# EasyEDA Pro project ProPrj_STM32 数控可调直流电源_2026-05-18.epro, schematic Schematic1

## Sheets
1 电源: Board Name: Board1; Create Date: 2026-03-24; Page Name: 电源; Project Name: STM32 数控可调直流电源; Schematic Name: Schematic1; Update Date: 2026-04-09; BladeWidth: 10; Company: 嘉立创EDA; Page Size: A4; RegionStart: 1; ShowBorder: 1; TitleBlock: 1; TitleBlockPosition: 3; Version: V1.0; XRegionCount: 6; YRegionCount: 4
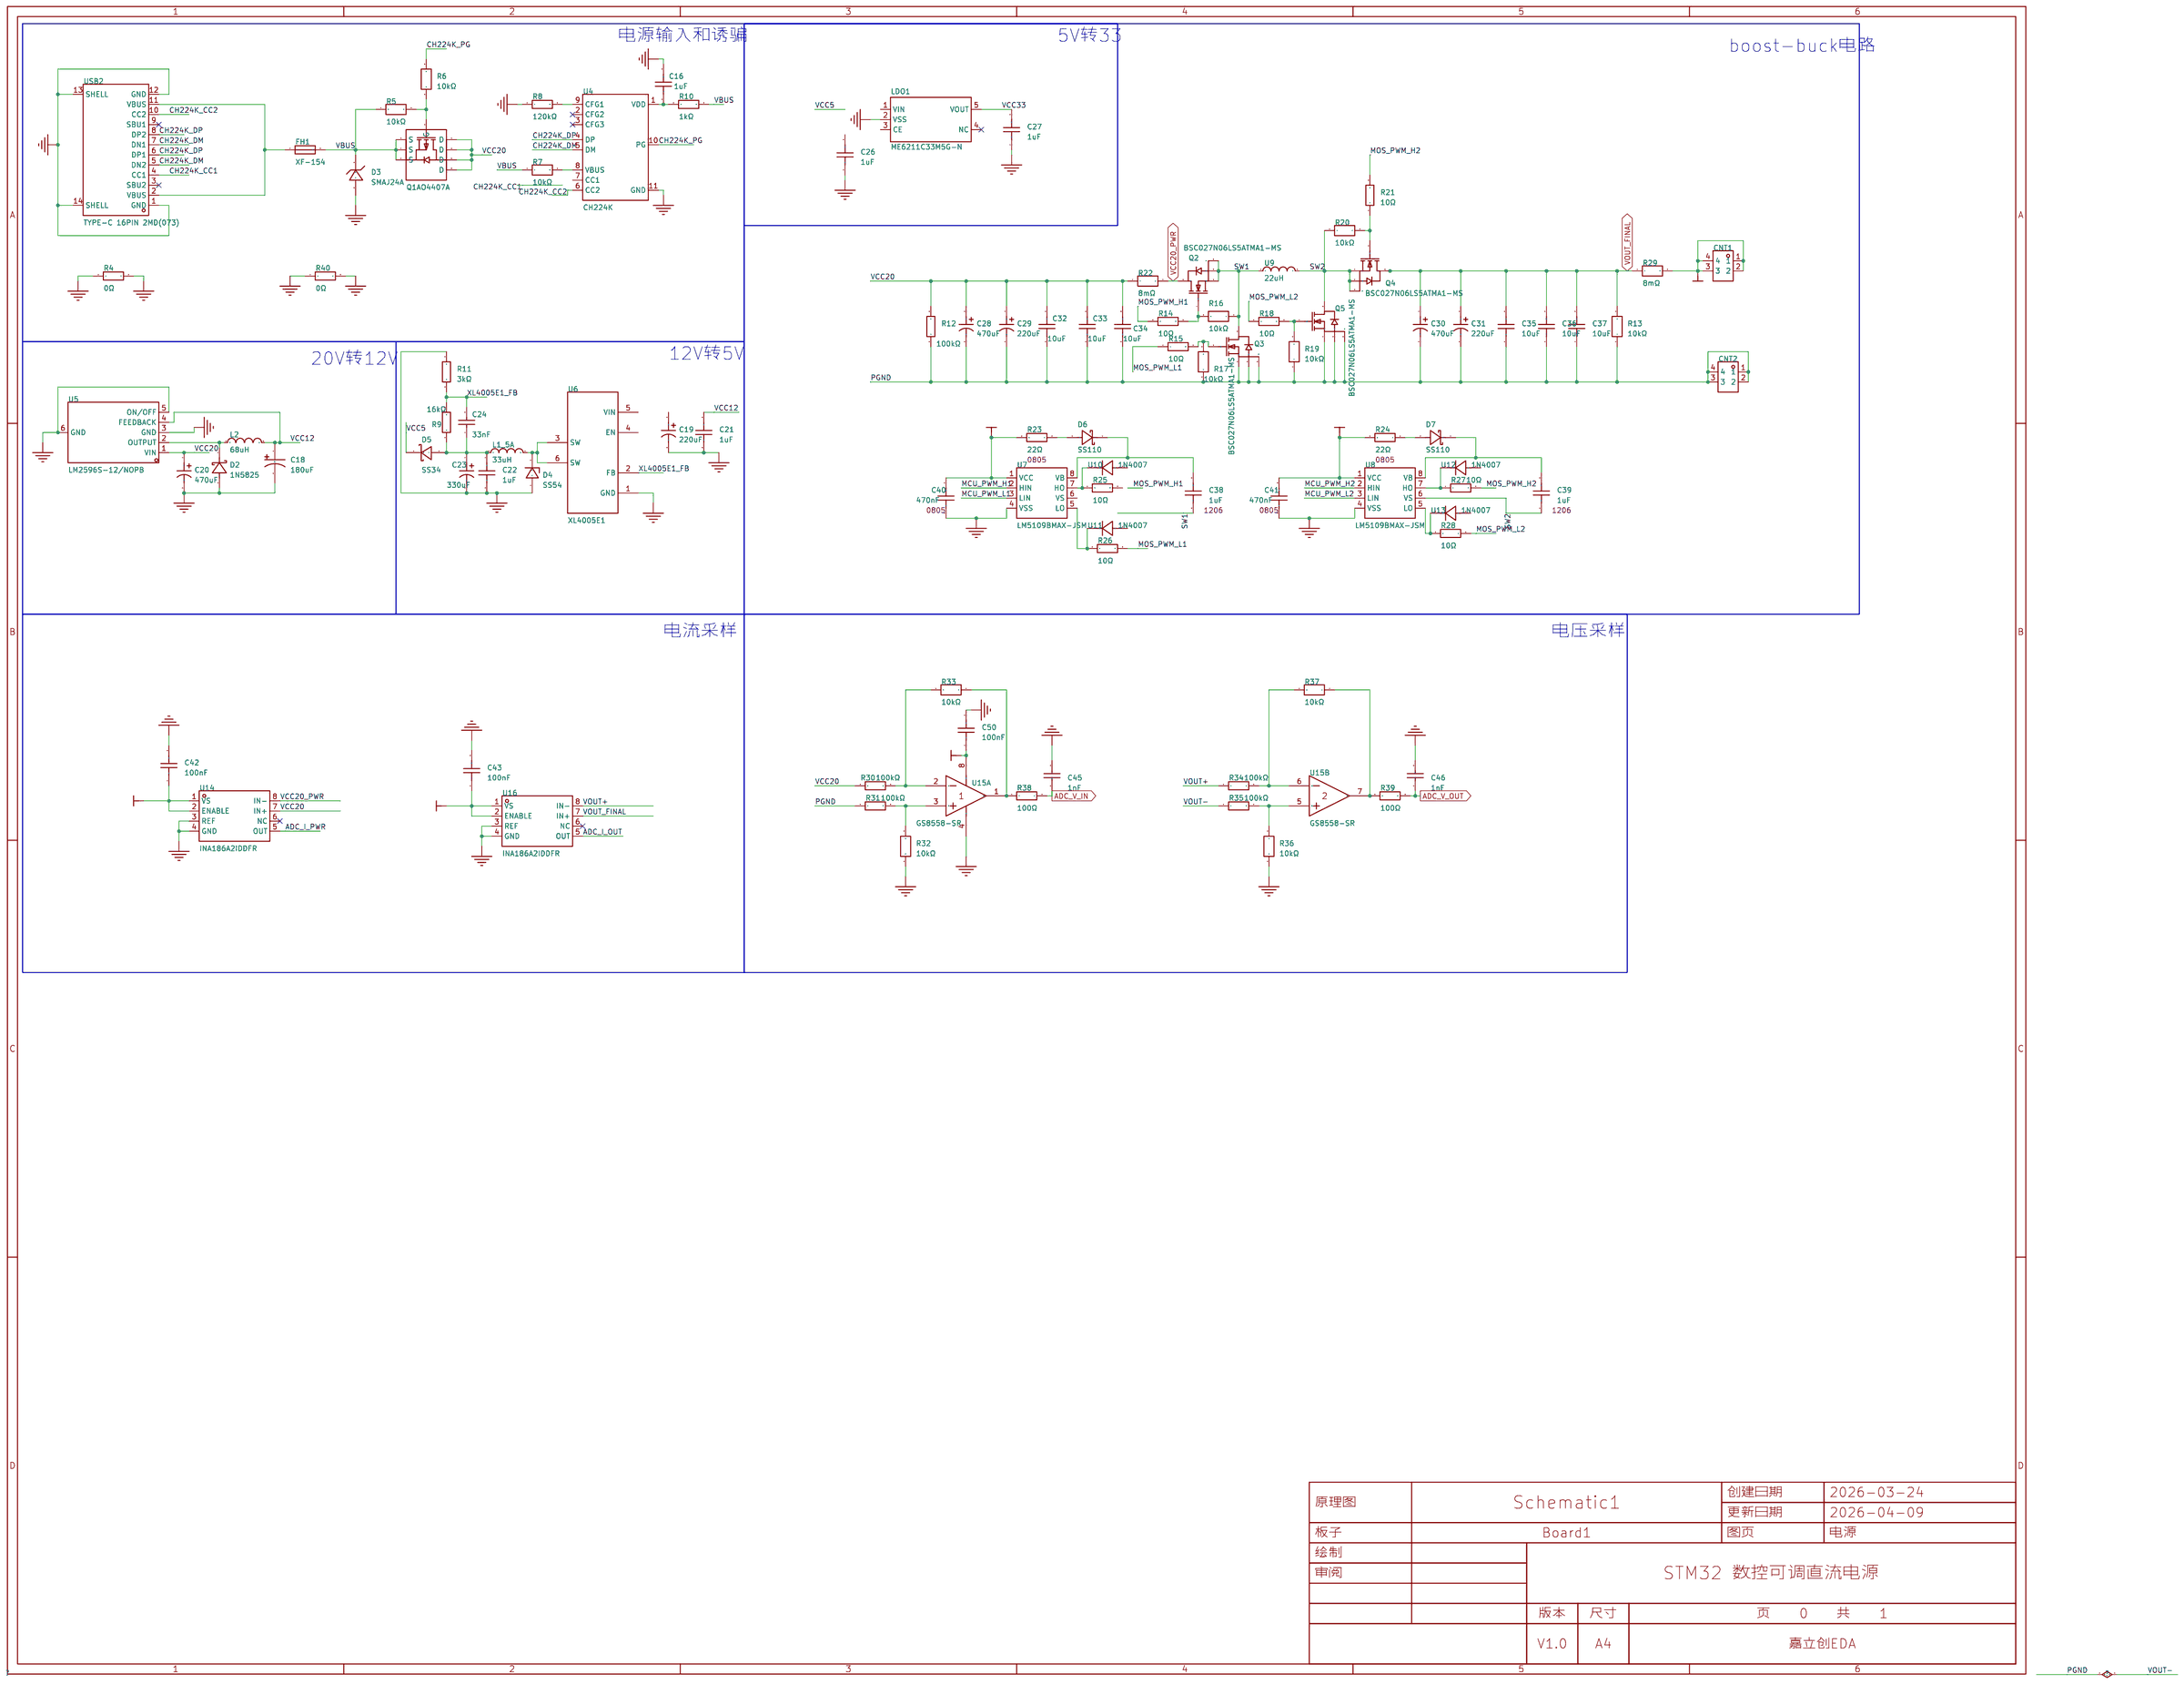
[diagram p0: 电源]
2 主控: Assembly Variant: Basic; Page Name: P2; Update Date: 2026-03-24
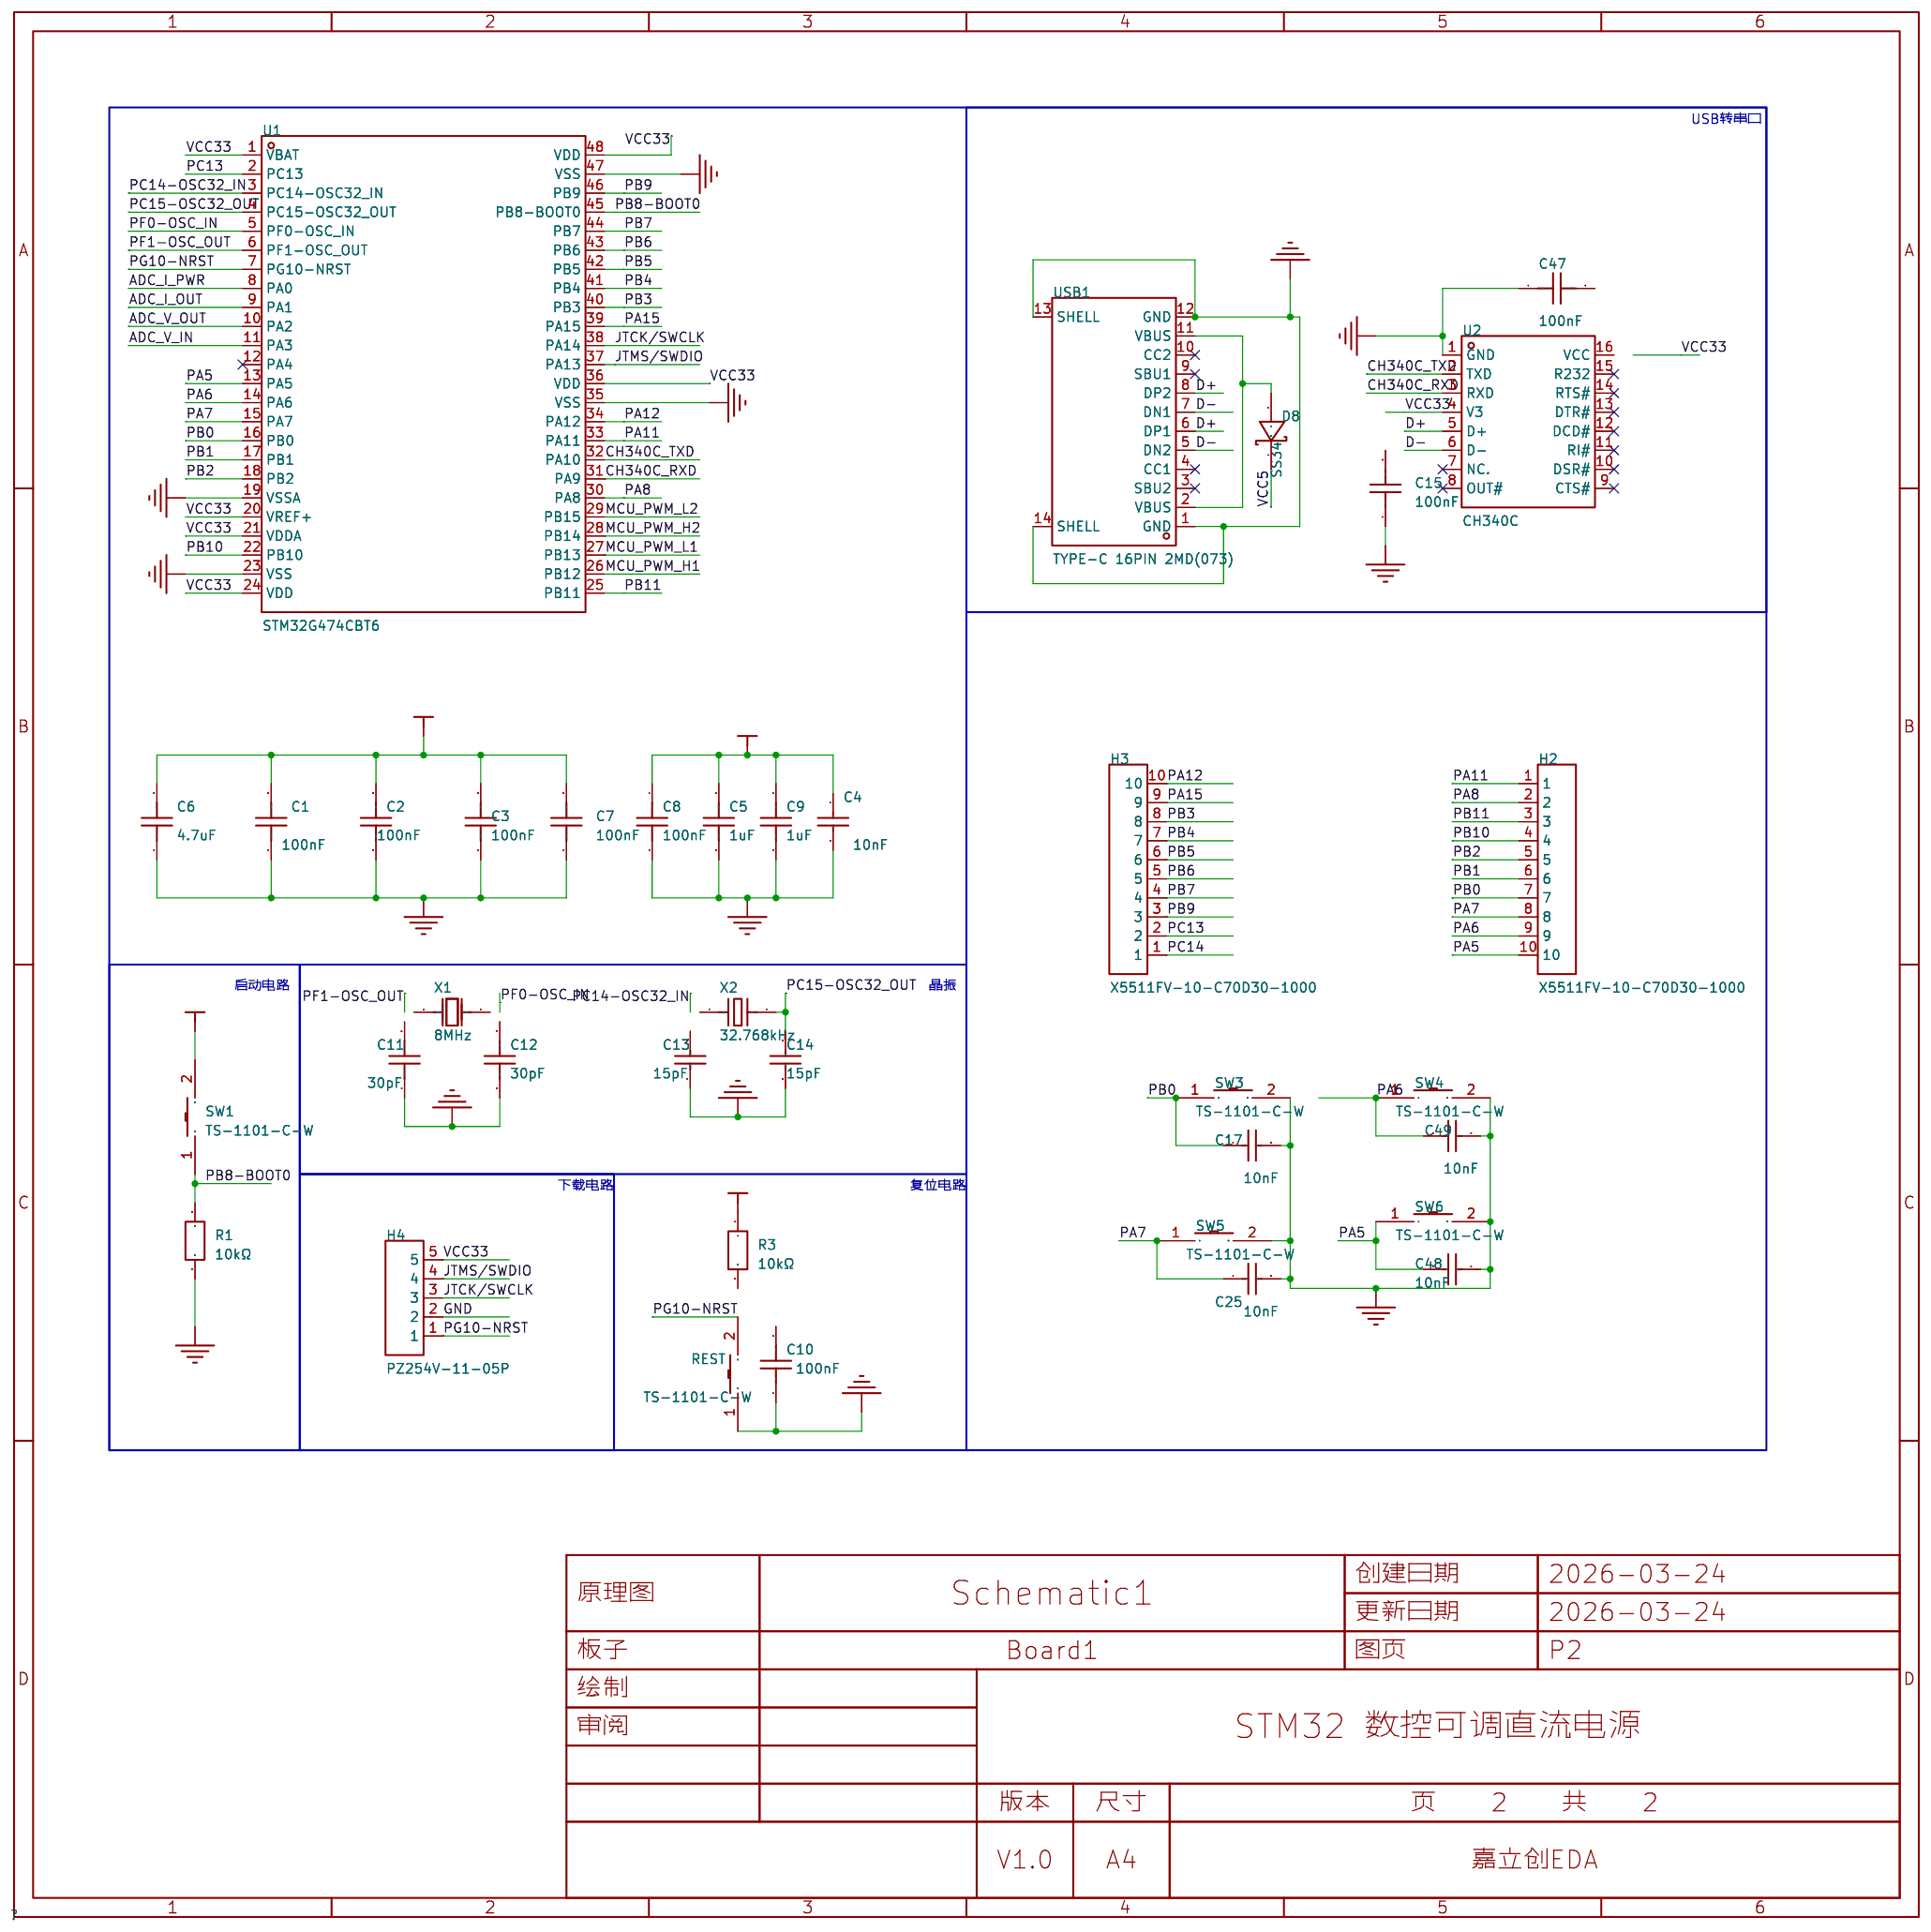
[diagram p1: 主控]

## Parts
sheet 主控
C1  100nF  [C0603]
C2  100nF  [C0603]
C3  100nF  [C0603]
C4  10nF  [C0603]
C5  1uF  [C0603]
C6  4.7uF  [C0603]
C7  100nF  [C0603]
C8  100nF  [C0603]
C9  1uF  [C0603]
C10  100nF  [C0603]
C11  30pF  [C0603]
C12  30pF  [C0603]
C13  15pF  [C0603]
C14  15pF  [C0603]
C15  100nF  [C0603]
C17  10nF  [C0603]
C25  10nF  [C0603]
C47  100nF  [C0603]
C48  10nF  [C0603]
C49  10nF  [C0603]
D8  SS34  [SMC_L6.9-W5.9-LS7.9-RD]
H2  X5511FV-10-C70D30-1000  [HDR-TH_10P-P2.54-V-F]
H3  X5511FV-10-C70D30-1000  [HDR-TH_10P-P2.54-V-F]
H4  PZ254V-11-05P  [HDR-TH_5P-P2.54-V-M]
R1  10kΩ  [R0603]
R3  10kΩ  [R0603]
REST  TS-1101-C-W  [SW-SMD_L6.0-W3.3-LS8.0]
SW1  TS-1101-C-W  [SW-SMD_L6.0-W3.3-LS8.0]
SW3  TS-1101-C-W  [SW-SMD_L6.0-W3.3-LS8.0]
SW4  TS-1101-C-W  [SW-SMD_L6.0-W3.3-LS8.0]
SW5  TS-1101-C-W  [SW-SMD_L6.0-W3.3-LS8.0]
SW6  TS-1101-C-W  [SW-SMD_L6.0-W3.3-LS8.0]
U1  STM32G474CBT6  [LQFP-48_L7.0-W7.0-P0.50-LS9.0-BL]
U2  CH340C  [SOP-16_L10.0-W3.9-P1.27-LS6.0-BL]
USB1  TYPE-C 16PIN 2MD(073)  [USB-C-SMD_TYPE-C-6PIN-2MD-073]
X1  8MHz  [CRYSTAL-SMD_L11.5-W4.8-LS12.7]
X2  32.768kHz  [OSC-SMD_L3.2-W1.5]
sheet 电源
C16  1uF  [C0603]
C18  180uF  [CAP-TH_BD8.0-P3.50-D0.6-FD]
C19  220uF  [CAP-TH_BD8.0-P3.50-D0.5-FD]
C20  470uF  [CAP-TH_BD10.0-P5.00-D0.6-FD]
C21  1uF  [C0603]
C22  1uF  [C0603]
C23  330uF  [CAP-TH_BD8.0-P3.50-D0.5-FD]
C24  33nF  [C0603]
C26  1uF  [C0603]
C27  1uF  [C0603]
C28  470uF  [CAP-TH_BD10.0-P5.00-D0.6-FD-A]
C29  220uF  [CAP-TH_BD10.0-P5.00-D0.6-FD_ERG50V220M10X13]
C30  470uF  [CAP-TH_BD10.0-P5.00-D0.6-FD-A]
C31  220uF  [CAP-TH_BD10.0-P5.00-D0.6-FD_ERG50V220M10X13]
C32  10uF  [C0805]
C33  10uF  [C0805]
C34  10uF  [C0805]
C35  10uF  [C0805]
C36  10uF  [C0805]
C37  10uF  [C0805]
C38  1uF  [C1206]
C39  1uF  [C1206]
C40  470nF  [C0805]
C41  470nF  [C0805]
C42  100nF  [C0603]
C43  100nF  [C0603]
C45  1nF  [C0603]
C46  1nF  [C0603]
C50  100nF  [C0603]
CNT1  T34001  [CONN-TH_T34001]
CNT2  T34001  [CONN-TH_T34001]
D2  1N5825  [DIO-TH_BD11.4-L8.9-P13.7-RD]
D3  SMAJ24A  [SMA_L4.4-W2.6-LS5.0-RD]
D4  SS54  [SMA_L4.3-W2.6-LS5.0-FD]
D5  SS34  [SMC_L6.9-W5.9-LS7.9-RD]
D6  SS110  [SMA_L4.3-W2.6-LS5.0-RD]
D7  SS110  [SMA_L4.3-W2.6-LS5.0-RD]
FH1  XF-154  [FUSE-SMD_L10.5-W5.1]
L1_5A  33uH  [IND-SMD_L11.5-W10.5]
L2  68uH  [IND-SMD_L12.3-W12.3_SMDRI127]
LDO1  ME6211C33M5G-N  [SOT-23-5_L3.0-W1.7-P0.95-LS2.8-BL]
Q1  AO4407A  [SOIC-8_L4.9-W3.9-P1.27-LS6.0-BL]
Q2  BSC027N06LS5ATMA1-MS  [TDSON-8_L5.9-W5.2-P1.27-BL-1]
Q3  BSC027N06LS5ATMA1-MS  [TDSON-8_L5.9-W5.2-P1.27-BL-1]
Q4  BSC027N06LS5ATMA1-MS  [TDSON-8_L5.9-W5.2-P1.27-BL-1]
Q5  BSC027N06LS5ATMA1-MS  [TDSON-8_L5.9-W5.2-P1.27-BL-1]
R4  0Ω  [R0603]
R5  10kΩ  [R0603]
R6  10kΩ  [R0603]
R7  10kΩ  [R0603]
R8  120kΩ  [R0603]
R9  16kΩ  [R0603]
R10  1kΩ  [R0603]
R11  3kΩ  [R0603]
R12  100kΩ  [R0603]
R13  10kΩ  [R0603]
R14  10Ω  [R0603]
R15  10Ω  [R0603]
R16  10kΩ  [R0603]
R17  10kΩ  [R0603]
R18  10Ω  [R0603]
R19  10kΩ  [R0603]
R20  10kΩ  [R0603]
R21  10Ω  [R0603]
R22  8mΩ  [RES-SMD_L6.4-W3.2-R2512]
R23  22Ω  [R0805]
R24  22Ω  [R0805]
R25  10Ω  [R0603]
R26  10Ω  [R0603]
R27  10Ω  [R0603]
R28  10Ω  [R0603]
R29  8mΩ  [RES-SMD_L6.4-W3.2-R2512]
R30  100kΩ  [R0603]
R31  100kΩ  [R0603]
R32  10kΩ  [R0603]
R33  10kΩ  [R0603]
R34  100kΩ  [R0603]
R35  100kΩ  [R0603]
R36  10kΩ  [R0603]
R37  10kΩ  [R0603]
R38  100Ω  [R0603]
R39  100Ω  [R0603]
R40  0Ω  [R0603]
U4  CH224K  [ESSOP-10_L4.9-W3.9-P1.0-LS6.0-TL-EP]
U5  LM2596S-12/NOPB  [TO-263-5_L10.6-W9.6-P1.70-LS15.9-TL]
U6  XL4005E1  [TO-263-5_L10.2-W9.2-P1.70-TL]
U7  LM5109BMAX-JSM  [SOIC-8_L5.0-W4.0-P1.27-LS6.1-BL]
U8  LM5109BMAX-JSM  [SOIC-8_L5.0-W4.0-P1.27-LS6.1-BL]
U9  22uH  [IND-SMD_L13.8-W12.8]
U10  1N4007  [SMA_L4.3-W2.6-LS5.1-RD]
U11  1N4007  [SMA_L4.3-W2.6-LS5.1-RD]
U12  1N4007  [SMA_L4.3-W2.6-LS5.1-RD]
U13  1N4007  [SMA_L4.3-W2.6-LS5.1-RD]
U14  INA186A2IDDFR  [TSOT-23-8_L2.9-W1.6-P0.65-LS2.8-BL]
U15  GS8558-SR  [SOIC-8_L4.9-W3.8-P1.27-LS6.0-BL]  (sections 1,2)
U16  INA186A2IDDFR  [TSOT-23-8_L2.9-W1.6-P0.65-LS2.8-BL]
USB2  TYPE-C 16PIN 2MD(073)  [USB-C-SMD_TYPE-C-6PIN-2MD-073]

## Library data of the parts
C1-C3 C7 C8 C10 = CGA0603X7R104K500JT: 容值:100nF;精度:±10%;额定电压:50V;温度系数:X7R;; LCSC Part Name: 100nF ±10% 50V; Supplier Part: C6119867; Manufacturer: HRE(芯声); Supplier Footprint: 0603; JLCPCB Part Class: Extended Part; Datasheet: https://item.szlcsc.com/datasheet/CGA0603X7R104K500JT/7062573.html; Supplier: LCSC; Tolerance: ±10%; Voltage Rating: 50V; Temperature Coefficient: X7R
C4 C17 C25 C48 C49 = CC0603KRX7R9BB103: 容值:10nF;精度:±10%;额定电压:50V;温度系数:X7R;; LCSC Part Name: 10nF ±10% 50V; Supplier Part: C100042; Manufacturer: YAGEO(国巨); Supplier Footprint: 0603; JLCPCB Part Class: Extended Part; Datasheet: https://item.szlcsc.com/datasheet/CC0603KRX7R9BB103/101256.html; Supplier: LCSC; Tolerance: ±10%; Voltage Rating: 50V; Temperature Coefficient: X7R
C5 C9 C16 C21 C22 C26 C27 = CGA0603X5R105K500JT: 容值:1uF;精度:±10%;额定电压:50V;温度系数:X5R;; LCSC Part Name: 1uF ±10% 50V; Supplier Part: C6119852; Manufacturer: HRE(芯声); Supplier Footprint: 0603; JLCPCB Part Class: Extended Part; Datasheet: https://item.szlcsc.com/datasheet/CGA0603X5R105K500JT/7062558.html; Supplier: LCSC; Tolerance: ±10%; Voltage Rating: 50V; Temperature Coefficient: X5R
C6 = CAP_0603: Supplier Footprint: 0603; LCSC Part Name: 4.7uF ±10% 10V; Supplier Part: C7503507; Manufacturer: HRE(芯声); Manufacturer Part: CGA0603X5R475K100JT; JLCPCB Part Class: Extended Part; Datasheet: https://item.szlcsc.com/datasheet/CGA0603X5R475K100JT/8593405.html; Supplier: LCSC; Tolerance: ±10%; Voltage Rating: 10V; Temperature Coefficient: X5R; PCB Layer: TopLayer
C11 C12 = CGA0603C0G300J500JT: 容值:30pF;精度:±5%;额定电压:50V;温度系数:C0G;; LCSC Part Name: 30pF ±5% 50V; Supplier Part: C20069404; Manufacturer: HRE(芯声); Supplier Footprint: 0603; JLCPCB Part Class: Extended Part; Datasheet: https://item.szlcsc.com/datasheet/CGA0603C0G300J500JT/21397665.html; Supplier: LCSC; Tolerance: ±5%; Voltage Rating: 50V; Temperature Coefficient: C0G
C13 C14 = CC0603JRNPO9BN150: 容值:15pF;精度:±5%;额定电压:50V;温度系数:NP0;; LCSC Part Name: 15pF ±5% 50V; Supplier Part: C107037; Manufacturer: YAGEO(国巨); Supplier Footprint: 0603; JLCPCB Part Class: Extended Part; Datasheet: https://item.szlcsc.com/datasheet/CC0603JRNPO9BN150/108253.html; Supplier: LCSC; Tolerance: ±5%; Voltage Rating: 50V; Temperature Coefficient: NP0
C15 C42 C43 C47 C50 = CL10B104KB8NNNC: 容值:100nF;精度:±10%;额定电压:50V;温度系数:X7R;; LCSC Part Name: 100nF ±10% 50V; Supplier Part: C1591; Manufacturer: SAMSUNG(三星); Supplier Footprint: 0603; JLCPCB Part Class: Extended Part; Datasheet: https://item.szlcsc.com/datasheet/CL10B104KB8NNNC/1943.html; Supplier: LCSC; Tolerance: ±10%; Voltage Rating: 50V; Temperature Coefficient: X7R
D5 D8 = SS34_C154551: 正向压降(Vf):500mV@3A;直流反向耐压(Vr):40V;整流电流:3A;; LCSC Part Name: 电压:40V 电流:3A; Supplier Part: C154551; Manufacturer: onsemi(安森美); Supplier Footprint: SMC(DO-214AB); JLCPCB Part Class: Extended Part; Datasheet: https://item.szlcsc.com/datasheet/SS34/165893.html; Supplier: LCSC; Voltage - Forward(Vf@If): 500mV@3A; Voltage - DC Reverse(Vr): 40V; Current - Rectified: 3A; Reverse Leakage Current (Ir): 500uA@40V; Operating Junction Temperature Range: -55℃~+150℃; Non-Repetitive Peak Forward Surge Current: 100A
H2 H3 = X5511FV-10-C70D30-1000: 插孔结构:1x10P;间距:2.54mm;行距:-;圆孔/方孔:圆孔;安装方式:直插;排数:单排;总孔位数:10P;额定电流:3A;额定电压:-;插孔方向:顶部;塑高:7mm;触头材质:黄铜;触头镀层:金;工作温度:-40℃~+105℃;; LCSC Part Name: 间距:2.54mm 1x10P 直插; Supplier Part: C2684744; Manufacturer: XKB Connection(中国星坤); Supplier Footprint: 插件,P=2.54mm; JLCPCB Part Class: Extended Part; Datasheet: https://item.szlcsc.com/datasheet/X5511FV-10-C70D30-1000/2783313.html; Supplier: LCSC; Holes Structure: 1x10P; Pitch: 2.54mm; Circular Hole / Square Hole: 圆孔; Mounting Type: 直插; Number of Rows: 单排; Number of Positions: 10P; Current Rating: 3A; Holes Direction: 顶部; Insulation Height: 7mm; Contact Material: 黄铜; Contact Plating: 金; Operating Temperature: -40℃~+105℃
H4 = PZ254V-11-05P: 插针结构:1x5P;间距:2.54mm;行距:-;圆针/方针:方针;安装方式:直插;排数:单排;总PIN位数:5P;额定电流:3A;额定电压:250V;配合针长度:6mm;塑高:2.5mm;端接针长度:3mm;触头材质:黄铜;触头镀层:-;工作温度:-40℃~+105℃;颜色:黑色;; LCSC Part Name: 1x5P 间距:2.54mm 方针 直插; Supplier Part: C492404; Manufacturer: XFCN(兴飞); Supplier Footprint: 插件,P=2.54mm; JLCPCB Part Class: Extended Part; Datasheet: https://item.szlcsc.com/datasheet/PZ254V-11-05P/502960.html; Supplier: LCSC; Pin Structure: 1x5P; Pitch: 2.54mm; Circluar Pins/Square Pins: 方针; Mounting Type: 直插; Number of Rows: 单排; Number of Pins: 5P; Current Rating: 3A; Voltage Rating (Max): 250V; Length of Mating Pin: 6mm; Insulation Height: 2.5mm; Length of End Connection Pin: 3mm; Contact Material: 黄铜; Operating Temperature: -40℃~+105℃; Color: 黑色
R1 R3 R5-R7 R13 R16 R17 R19 R20 R32 R33 R36 R37 = FRC0603F1002TS: 电阻类型:厚膜电阻;阻值:10kΩ;精度:±1%;功率:100mW;工作电压:75V;温度系数:±100ppm/℃;; LCSC Part Name: 10kΩ ±1% 100mW 厚膜电阻; Supplier Part: C2906982; Manufacturer: FOJAN(富捷); Supplier Footprint: 0603; JLCPCB Part Class: Extended Part; Supplier: LCSC; Type: 厚膜电阻; Tolerance: ±1%; Power(Watts): 100mW; Voltage-Supply(Max): 75V; Temperature Coefficient: ±100ppm/℃; Operating Temperature: -55℃~+155℃
REST SW1 SW3-SW6 = TS-1101-C-W: 电路结构:单刀单掷;按钮形状:矩形按钮;作用力:260gf;安装方式:立贴;开关长度:6mm;开关宽度:3.6mm;开关高度:2.5mm;带支架:不带;触点电流:50mA;额定电压(AC):-;额定电压(DC):12V;额定功率:-;绝缘电阻:-;带灯:无;机械寿命:5万次;; LCSC Part Name: 6*3.6*2.5mm 立贴 轻触开关; Supplier Part: C318938; Manufacturer: XKB Connectivity(中国星坤); Supplier Footprint: SMD; JLCPCB Part Class: Extended Part; Datasheet: https://atta.szlcsc.com/upload/public/pdf/source/20200227/C318938_C2E53B1EEDE37D980A33616AC086DE53.pdf; Supplier: LCSC; Circuit: 单刀单掷; Actuator Style: 矩形按钮; Operating Force: 260gf; Mounting Style: 立贴; Switch Length: 6mm; Switch Width: 3.6mm; Switch Height: 2.5mm; Strike Gundam: 不带; Contact Current: 50mA; Voltage Rating (DC): 12V; Actuator/Cap Color: 白色带淡绿; With Lamp: 无; Mechanical Life: 5万次; Operating Temperature: -30℃~+85℃
U1 = STM32G474CBT6: CPU内核:ARM Cortex-M4F;CPU最大主频:170MHz;CPU位数:32 Bit;; LCSC Part Name: Arm Cortex-M4 32位MCU+FPU，170 MHz/213 DMIPS，128 KB SRAM，丰富的模拟功能、数学加速器，184 ps 12通道高分辨率定时器; Supplier Part: C730123; Manufacturer: ST(意法半导体); Supplier Footprint: LQFP-48(7x7); JLCPCB Part Class: Extended Part; Datasheet: https://item.szlcsc.com/datasheet/STM32G474CBT6/778078.html; Supplier: LCSC; CPU Core: ARM Cortex-M4F; CPU Maximum Speed: 170MHz; Core Size: 32 Bit; Program Storage Size: 128KB; Program Memory Type: FLASH; RAM Size: 128KB; Number of I/O: 38; ADC (Bit): 12bit; DAC (Bit): 12bit; Oscillator Type: 内置; Voltage - Supply: 1.71V~3.6V; Operating Temperature: -40℃~+85℃
U2 = CH340C: 应用功能:收发器;USB协议版本:USB 2.0;数据速率:2Mbps;; LCSC Part Name: USB转串口芯片; Supplier Part: C84681; Manufacturer: WCH(南京沁恒); Supplier Footprint: SOP-16; JLCPCB Part Class: Extended Part; Datasheet: https://item.szlcsc.com/datasheet/CH340C/85852.html; Supplier: LCSC; Applications Function: 收发器; USB Protocol: USB 2.0; Voltage - Supply: 3.3V；5V; Data Rate: 2Mbps; Operating Temperature: -20℃~+70℃; Current - Supply: 7mA; Supply Current (Iq): 50uA
USB1 USB2 = TYPE-C 16PIN 2MD(073): 连接器类型:Type-C;协议标准:-;公母:母;安装方式:卧贴;触点数量:16P;端口数量:1;额定电流 - 电源:3A;工作温度:-25℃~+85℃;; LCSC Part Name: 16P卧贴母座; Supplier Part: C2765186; Manufacturer: SHOU HAN(首韩); Supplier Footprint: SMD; JLCPCB Part Class: Extended Part; Datasheet: https://item.szlcsc.com/datasheet/TYPE-C%252016PIN%25202MD(073)/2901843.html; Supplier: LCSC; Connector Type: Type-C; Gender: 母; Mounting Type: 卧贴; Number of Contacts: 16P; Number of Ports: 1; Current Rating-Power: 3A; Voltage Rating: 5V; Connect-Disconnect Life: 5千次; Detection color: 黑色; Operating Temperature: -25℃~+85℃
X1 = X49SM8MSD2SC: 晶振类型:贴片晶振;频率:8MHz;常温频差:±20ppm;负载电容:20pF;频率稳定度:±30ppm;; LCSC Part Name: HC-49SMD 8MHZ 20PF ±20PPM -20~70℃（±30PPM）; Supplier Part: C12674; Manufacturer: YXC(扬兴晶振); Supplier Footprint: HC-49S-SMD; JLCPCB Part Class: Basic Part; Datasheet: https://item.szlcsc.com/datasheet/X49SM8MSD2SC/13310.html; Supplier: LCSC; Type: 贴片晶振; Normal temperature Frequency Tolerance: ±20ppm; Load Capacitance: 20pF; Frequency Stability: ±30ppm; Operating Temperature: -20℃~+70℃
X2 = X321532768KGD2SI: 晶振类型:贴片晶振;频率:32.768kHz;常温频差:±20ppm;负载电容:12.5pF;频率稳定度:±30ppm;; LCSC Part Name: YST310S 32.768KHZ 2P 3215 12.5PF ±20PPM -40~85℃; Supplier Part: C620155; Manufacturer: YXC(扬兴晶振); Supplier Footprint: SMD3215-2P; JLCPCB Part Class: Extended Part; Datasheet: https://item.szlcsc.com/datasheet/X321532768KGD2SI/649983.html; Supplier: LCSC; Type: 贴片晶振; Normal temperature Frequency Tolerance: ±20ppm; Load Capacitance: 12.5pF; Frequency Stability: ±30ppm; Operating Temperature: -40℃~+85℃
C18 = LKMD0901V181MF: 容值:180uF;精度:±20%;额定电压:35V;纹波电流:900mA@100kHz;等效串联电阻:210mΩ@100kHz;; LCSC Part Name: 180uF ±20% 35V; Supplier Part: C442870; Manufacturer: Ymin(永铭); Supplier Footprint: 插件,D8xL9mm; JLCPCB Part Class: Extended Part; Datasheet: https://atta.szlcsc.com/upload/public/pdf/source/20200220/C487520_443A40905984A455D375EE990FEAA9E8.pdf; Supplier: LCSC; Tolerance: ±20%; Rated Voltage: 35V; Ripple Current: 900mA@100kHz; Equivalent Series Resistance(ESR): 210mΩ@100kHz; Lead Spacing: 3.5mm; φD: 8mm; L: 9mm; Lifetime @ Temp: 10000hrs@105℃
C19 = ERA35V220M8X12: 容值:220uF;精度:±20%;额定电压:35V;; LCSC Part Name: 220uF ±20% 35V; Supplier Part: C49256804; Manufacturer: JIERR(捷而瑞); Supplier Footprint: 插件,D8xL12mm; JLCPCB Part Class: Extended Part; Datasheet: https://item.szlcsc.com/datasheet/ERA35V220M8X12/51692204.html; Supplier: LCSC; Tolerance: ±20%; Voltage Rating: 35V; Pin Spacing: 3.5mm; Diameter: 8mm; Height - Seated (Max): 12mm; Lifetime: 2000hrs@105℃; Operating Temperature: -40℃~+105℃
C20 = ERA50V470M10X20: 容值:470uF;精度:±20%;额定电压:50V;; LCSC Part Name: 470uF ±20% 50V; Supplier Part: C49256816; Manufacturer: JIERR(捷而瑞); Supplier Footprint: 插件,D10xL20mm; JLCPCB Part Class: Extended Part; Datasheet: https://item.szlcsc.com/datasheet/ERA50V470M10X20/51692216.html; Supplier: LCSC; Tolerance: ±20%; Voltage Rating: 50V; Pin Spacing: 5mm; Diameter: 10mm; Height - Seated (Max): 20mm; Lifetime: 2000hrs@105℃; Operating Temperature: -40℃~+105℃
C23 = ERA25V330M8X12: 容值:330uF;精度:±20%;额定电压:25V;; LCSC Part Name: 330uF ±20% 25V; Supplier Part: C49256796; Manufacturer: JIERR(捷而瑞); Supplier Footprint: 插件,D8xL12mm; JLCPCB Part Class: Extended Part; Datasheet: https://item.szlcsc.com/datasheet/ERA25V330M8X12/51692196.html; Supplier: LCSC; Tolerance: ±20%; Voltage Rating: 25V; Pin Spacing: 3.5mm; Diameter: 8mm; Height - Seated (Max): 12mm; Lifetime: 2000hrs@105℃; Operating Temperature: -40℃~+105℃
C24 = CC0603KRX7R9BB333: 容值:33nF;精度:±10%;额定电压:50V;温度系数:X7R;; LCSC Part Name: 33nF ±10% 50V; Supplier Part: C106856; Manufacturer: YAGEO(国巨); Supplier Footprint: 0603; JLCPCB Part Class: Extended Part; Datasheet: https://item.szlcsc.com/datasheet/CC0603KRX7R9BB333/108072.html; Supplier: LCSC; Tolerance: ±10%; Voltage Rating: 50V; Temperature Coefficient: X7R
C28 C30 = PA50V470M10x17: 容值:470uF;精度:±20%;额定电压:50V;纹波电流:4.1A@100kHz;等效串联电阻(ESR):18mΩ@100kHz;类型:聚合物;; LCSC Part Name: 470uF ±20% 50V; Supplier Part: C46550425; Manufacturer: JIERR(捷而瑞); Supplier Footprint: 插件,D10xL17mm; JLCPCB Part Class: Extended Part; Datasheet: https://item.szlcsc.com/datasheet/PA50V470M10x17/48680119.html; Supplier: LCSC; Tolerance: ±20%; Voltage Rating: 50V; Ripple Current: 4.1A@100kHz; Equivalent Series Resistance(ESR): 18mΩ@100kHz; Type: 聚合物; Diameter: 10mm; Height - Seated (Max): 17mm; Lifetime: 2000hrs@105℃; Operating Temperature: -55℃~+105℃
C29 C31 = ERG50V220M10X13: 容值:220uF;精度:±20%;额定电压:50V;等效串联电阻(ESR):120mΩ@100KHz;; LCSC Part Name: 220uF ±20% 50V; Supplier Part: C51904472; Manufacturer: JIERR(捷而瑞); Supplier Footprint: 插件,D10xL13mm; JLCPCB Part Class: Extended Part; Datasheet: https://item.szlcsc.com/datasheet/ERG50V220M10X13/54596841.html; Supplier: LCSC; Tolerance: ±20%; Voltage Rating: 50V; Equivalent Series Resistance(ESR): 120mΩ@100KHz; Diameter: 10mm; Height - Seated (Max): 13mm; Operating Temperature: -40℃~+105℃
C32-C37 = CGA0805X5R106K500MT: 容值:10uF;精度:±10%;额定电压:50V;温度系数:X5R;; LCSC Part Name: 10uF ±10% 50V; Supplier Part: C6119889; Manufacturer: HRE(芯声); Supplier Footprint: 0805; JLCPCB Part Class: Extended Part; Datasheet: https://item.szlcsc.com/datasheet/CGA0805X5R106K500MT/7062595.html; Supplier: LCSC; Tolerance: ±10%; Voltage Rating: 50V; Temperature Coefficient: X5R
C38 C39 = TCC1206X7R105M500HT: 容值:1uF;精度:±20%;额定电压:50V;温度系数:X7R;; LCSC Part Name: 1uF ±20% 50V; Supplier Part: C377070; Manufacturer: CCTC(三环); Supplier Footprint: 1206; JLCPCB Part Class: Extended Part; Datasheet: https://item.szlcsc.com/datasheet/TCC1206X7R105M500HT/349429.html; Supplier: LCSC; Tolerance: ±20%; Voltage Rating: 50V; Temperature Coefficient: X7R
C40 C41 = CL21B474KBFNNNE: 容值:470nF;精度:±10%;额定电压:50V;材质(温度系数):X7R;; LCSC Part Name: 470nF ±10% 50V; Supplier Part: C13967; Manufacturer: SAMSUNG(三星); Supplier Footprint: 0805; JLCPCB Part Class: Basic Part; Datasheet: https://atta.szlcsc.com/upload/public/pdf/source/20160218/1457707763339.pdf; Supplier: LCSC; Tolerance: ±10%; Voltage Rated: 50V; Temperature Coefficient: X7R
C45 C46 = CL10B102KB8NNNC: 容值:1nF;精度:±10%;额定电压:50V;温度系数:X7R;; LCSC Part Name: 1nF ±10% 50V; Supplier Part: C1588; Manufacturer: SAMSUNG(三星); Supplier Footprint: 0603; JLCPCB Part Class: Basic Part; Datasheet: https://item.szlcsc.com/datasheet/CL10B102KB8NNNC/1940.html; Supplier: LCSC; Tolerance: ±10%; Voltage Rating: 50V; Temperature Coefficient: X7R
CNT1 CNT2 = T34001: LCSC Part Name: 四脚 M3 二件套; Supplier Part: C481448; Manufacturer: XFCN(兴飞); Supplier Footprint: 插件; JLCPCB Part Class: 扩展库; Datasheet: https://atta.szlcsc.com/upload/public/pdf/source/20200107/C481448_4214B4EB74A46B70BD82BA8A456D4EDD.pdf; Supplier: LCSC
D2 = 1N5825_C3758179: 二极管配置:1个独立式;正向压降(Vf):380mV@5A;直流反向耐压(Vr):40V;整流电流:5A;; LCSC Part Name: 电压:40V 电流:5A; Supplier Part: C3758179; Manufacturer: MICROCHIP(美国微芯); Supplier Footprint: 插件; JLCPCB Part Class: Extended Part; Datasheet: https://item.szlcsc.com/datasheet/1N5825/4325709.html; Supplier: LCSC; Diode Configuration: 1个独立式; Voltage - Forward(Vf@If): 380mV@5A; Voltage - DC Reverse(Vr): 40V; Current - Rectified: 5A; Reverse Leakage Current (Ir): 10mA@40V; Operating Junction Temperature Range: -65℃~+125℃; Non-Repetitive Peak Forward Surge Current: 500A
D3 = SMAJ24A_C148222: 极性:单向;反向截止电压(Vrwm):24V;钳位电压:38.9V;峰值脉冲电流(Ipp):10.3A;峰值脉冲功率(Ppp):400W@10/1000us;击穿电压:29.5V;; LCSC Part Name: 单向TVS 24V截止 10.3A峰值脉冲; Supplier Part: C148222; Manufacturer: Littelfuse(美国力特); Supplier Footprint: DO-214AC(SMA); JLCPCB Part Class: Extended Part; Datasheet: https://item.szlcsc.com/datasheet/SMAJ24A/159555.html; Supplier: LCSC; Polarity: 单向; Reverse Stand-Off Voltage (Vrwm): 24V; Clamping Voltage: 38.9V; Peak Pulse Current (Ipp): 10.3A; Peak Pulse Power Dissipation (Ppp): 400W@10/1000us; Voltage - Breakdown: 29.5V; Reverse Leakage Current (Ir): 1uA; Operating Temperature: -65℃~+150℃; level of protection: IEC 61000-4-4；IEC 61000-4-2; Type: TVS
D4 = SS54_C7420369: 二极管配置:独立式;正向压降(Vf):550mV@5.0A;直流反向耐压(Vr):40V;整流电流:5A;; LCSC Part Name: 电压:40V 电流:5A; Supplier Part: C7420369; Manufacturer: R+O(宏嘉诚); Supplier Footprint: SMA(DO-214AC); JLCPCB Part Class: Extended Part; Datasheet: https://item.szlcsc.com/datasheet/SS54/8397191.html; Supplier: LCSC; Diode Configuration: 独立式; Voltage - Forward(Vf@If): 550mV@5.0A; Voltage - DC Reverse(Vr): 40V; Current - Rectified: 5A; Reverse Leakage Current (Ir): 50uA@40V; Operating Junction Temperature Range: -55℃~+125℃; Non-Repetitive Peak Forward Surge Current: 120A
D6 D7 = SS110_C18199178: 二极管配置:独立式;正向压降(Vf):850mV@1A;直流反向耐压(Vr):100V;整流电流:1A;; LCSC Part Name: 电压:100V 电流:1A; Supplier Part: C18199178; Manufacturer: R+O(宏嘉诚); Supplier Footprint: SMA(DO-214AC); JLCPCB Part Class: Extended Part; Datasheet: https://item.szlcsc.com/datasheet/SS110/19354410.html; Supplier: LCSC; Diode Configuration: 独立式; Voltage - Forward(Vf@If): 850mV@1A; Voltage - DC Reverse(Vr): 100V; Current - Rectified: 1A; Reverse Leakage Current (Ir): 50uA@100V; Operating Junction Temperature Range: -55℃~+150℃; Non-Repetitive Peak Forward Surge Current: 30A
FH1 = XF-154: 2410贴片保险座; Supplier Part: C41371861; Manufacturer: XFCN(兴飞); Supplier Footprint: SMD; JLCPCB Part Class: Extended Part; Datasheet: https://atta.szlcsc.com/upload/public/pdf/source/20240828/54540296E604CB321541E8B6C3E496A3.pdf; Supplier: LCSC
L1_5A = FCH1050-330M: 电感值:33uH;精度:±20%;额定电流:5A;饱和电流(Isat):6A;类型:一体成型电感;; LCSC Part Name: 33uH ±20% 6A; Supplier Part: C20415549; Manufacturer: FC(方成); Supplier Footprint: SMD,11.5x10.5mm; JLCPCB Part Class: Extended Part; Datasheet: https://atta.szlcsc.com/upload/public/pdf/source/20240103/319E317479D4D8C28434D6BBB351EBFE.pdf; Supplier: LCSC; Tolerance: ±20%; Rated Current: 5A; Saturation Current (Isat): 6A; DC Resistance (DCR): 72mΩ; Type: 一体成型电感
L2 = SMDRI127-680MT: 电感值:68uH;精度:±20%;额定电流:2.1A;饱和电流(Isat):4A;类型:磁胶屏蔽电感;; LCSC Part Name: 68uH ±20% 4A; Supplier Part: C9907; Manufacturer: SXN(顺翔诺); Supplier Footprint: SMD,12.3x12.3mm; JLCPCB Part Class: Extended Part; Datasheet: https://item.szlcsc.com/datasheet/SMDRI127-680MT/10439.html; Supplier: LCSC; Tolerance: ±20%; Current Rating: 2.1A; Current - Saturation(Isat): 4A; DC Resistance(DCR): 140mΩ; Type: 磁胶屏蔽电感
LDO1 = ME6211C33M5G-N: 输出类型:固定;工作电压:6V;输出电压:3.3V;输出电流:500mA;电源纹波抑制比(PSRR):70dB@(1kHz);输出极性:正极;; LCSC Part Name: 输入6V 输出3.3V 500mA; Supplier Part: C82942; Manufacturer: MICRONE(南京微盟); Supplier Footprint: SOT-23-5; JLCPCB Part Class: Extended Part; Datasheet: https://item.szlcsc.com/datasheet/ME6211C33M5G-N/84106.html; Supplier: LCSC; Output Type: 固定; Voltage - Supply: 6V; Output Voltage: 3.3V; Output Current: 500mA; Power Supply Rejection Ratio (PSRR): 70dB@(1kHz); Voltage Dropout: 120mV@(100mA); standby current: 60uA; Noise: 50uVrms; Features: 过流保护；带使能；短路保护; Operating Temperature: -40℃~+150℃; Output Configuration: 正极; Number of Outputs: 1
Q1 = AO4407A_C16072: 类型:1个P沟道;漏源电压(Vdss):30V;连续漏极电流(Id):12A;导通电阻(RDS(on)@Vgs,Id):11mΩ@20V,12A;功率(Pd):3.1W;阈值电压(Vgs(th)@Id):1.7V@250uA;; LCSC Part Name: 1个P沟道 耐压:30V 电流:12A; Supplier Part: C16072; Manufacturer: AOS; Supplier Footprint: SOIC-8; JLCPCB Part Class: Extended Part; Datasheet: https://atta.szlcsc.com/upload/public/pdf/source/20130807/1457706632699.pdf; Supplier: LCSC; Type: 1个P沟道; Drain Source Voltage (Vdss): 30V; Continuous Drain Current (Id): 12A; Drain Source On Resistance (RDS(on)@Vgs,Id): 11mΩ@20V,12A; Power Dissipation (Pd): 3.1W; Gate Threshold Voltage (Vgs(th)@Id): 1.7V@250uA; Total Gate Charge (Qg@Vgs): 39nC@10V; Input Capacitance (Ciss@Vds): 2.6nF@15V; Reverse Transfer Capacitance (Crss@Vds): 295pF@15V; Operating Temperature: -55℃~+150℃
Q2-Q5 = BSC027N06LS5ATMA1-MS: 此款BSC027N06LS5ATMA1-MS是一款N沟道场效应管（MOSFET）具备高性能与高稳定性的特点，适用于多种功率电子系统。其主要参数包括：最大漏极电流ID为125A，漏源击穿电压VDSS为60V，导通电阻RDON低至2.4mΩ，有助于降低导通损耗并提升系统效率。器件采用优化设计，具备快速开关响应和良好热稳定性，适合应用于电源转换器、储能系统、电机控制电路以及各类精密电子设备中的功率管理环节。; Supplier Part: C51927981; Manufacturer: MSKSEMI(美森科); Supplier Footprint: DFN-8L(5x6); JLCPCB Part Class: Extended Part; Datasheet: https://item.szlcsc.com/datasheet/BSC027N06LS5ATMA1-MS/54639572.html; Supplier: LCSC
R4 R40 = RC0603FR-070RL: 电阻类型:厚膜电阻;阻值:0Ω;精度:±1%;功率:100mW;工作电压:75V;温度系数:-;; LCSC Part Name: 厚膜电阻 0Ω ±1% 100mW; Supplier Part: C100044; Manufacturer: YAGEO(国巨); Supplier Footprint: 0603; JLCPCB Part Class: Extended Part; Datasheet: https://item.szlcsc.com/datasheet/RC0603FR-070RL/101258.html; Supplier: LCSC; Type: 厚膜电阻; Tolerance: ±1%; Power(Watts): 100mW; Voltage-Supply(Max): 75V; Operating Temperature: -55℃~+155℃
R8 = 0603WAF1203T5E: 电阻类型:厚膜电阻;阻值:120kΩ;精度:±1%;功率:100mW;工作电压:75V;温度系数:±100ppm/℃;; LCSC Part Name: 120kΩ ±1% 100mW 厚膜电阻; Supplier Part: C25808; Manufacturer: UNI-ROYAL(厚声); Supplier Footprint: 0603; JLCPCB Part Class: Basic Part; Datasheet: https://item.szlcsc.com/datasheet/0603WAF1203T5E/26551.html; Supplier: LCSC; Type: 厚膜电阻; Tolerance: ±1%; Power(Watts): 100mW; Voltage-Supply(Max): 75V; Temperature Coefficient: ±100ppm/℃; Operating Temperature: -55℃~+155℃
R9 = 0603WAF1602T5E: 电阻类型:厚膜电阻;阻值:16kΩ;精度:±1%;功率:100mW;工作电压:75V;温度系数:±100ppm/℃;; LCSC Part Name: 16kΩ ±1% 100mW 厚膜电阻; Supplier Part: C4210; Manufacturer: UNI-ROYAL(厚声); Supplier Footprint: 0603; JLCPCB Part Class: Extended Part; Datasheet: https://item.szlcsc.com/datasheet/0603WAF1602T5E/4617.html; Supplier: LCSC; Type: 厚膜电阻; Tolerance: ±1%; Power(Watts): 100mW; Voltage-Supply(Max): 75V; Temperature Coefficient: ±100ppm/℃; Operating Temperature: -55℃~+155℃
R10 = 0603WAF1001T5E: 电阻类型:厚膜电阻;阻值:1kΩ;精度:±1%;功率:100mW;工作电压:75V;温度系数:±100ppm/℃;; LCSC Part Name: 1kΩ ±1% 100mW 厚膜电阻; Supplier Part: C21190; Manufacturer: UNI-ROYAL(厚声); Supplier Footprint: 0603; JLCPCB Part Class: Basic Part; Datasheet: https://item.szlcsc.com/datasheet/0603WAF1001T5E/21904.html; Supplier: LCSC; Type: 厚膜电阻; Tolerance: ±1%; Power(Watts): 100mW; Voltage-Supply(Max): 75V; Temperature Coefficient: ±100ppm/℃; Operating Temperature: -55℃~+155℃
R11 = 0603WAF3001T5E: 电阻类型:厚膜电阻;阻值:3kΩ;精度:±1%;功率:100mW;工作电压:75V;温度系数:±100ppm/℃;; LCSC Part Name: 3kΩ ±1% 100mW 厚膜电阻; Supplier Part: C4211; Manufacturer: UNI-ROYAL(厚声); Supplier Footprint: 0603; JLCPCB Part Class: Basic Part; Datasheet: https://item.szlcsc.com/datasheet/0603WAF3001T5E/4618.html; Supplier: LCSC; Type: 厚膜电阻; Tolerance: ±1%; Power(Watts): 100mW; Voltage-Supply(Max): 75V; Temperature Coefficient: ±100ppm/℃; Operating Temperature: -55℃~+155℃
R12 R30 R31 R34 R35 = 0603WAF1003T5E: 电阻类型:厚膜电阻;阻值:100kΩ;精度:±1%;功率:100mW;工作电压:75V;温度系数:±100ppm/℃;; LCSC Part Name: 100kΩ ±1% 100mW 厚膜电阻; Supplier Part: C25803; Manufacturer: UNI-ROYAL(厚声); Supplier Footprint: 0603; JLCPCB Part Class: Basic Part; Datasheet: https://item.szlcsc.com/datasheet/0603WAF1003T5E/26546.html; Supplier: LCSC; Type: 厚膜电阻; Tolerance: ±1%; Power(Watts): 100mW; Voltage-Supply(Max): 75V; Temperature Coefficient: ±100ppm/℃; Operating Temperature: -55℃~+155℃
R14 R15 R18 R21 R25-R28 = RC0603FR-0710RL: 电阻类型:厚膜电阻;阻值:10Ω;精度:±1%;功率:100mW;最大工作电压:75V;温度系数:±200ppm/℃;; LCSC Part Name: 厚膜电阻 10Ω ±1% 100mW; Supplier Part: C109318; Manufacturer: YAGEO(国巨); Supplier Footprint: 0603; JLCPCB Part Class: Extended Part; Datasheet: https://atta.szlcsc.com/upload/public/pdf/source/20180316/70C0E2BDAE7FCC62C531A5A58D202EE1.pdf; Supplier: LCSC; Type: 厚膜电阻; Tolerance: ±1%; Power(Watts): 100mW; Overload Voltage (Max): 75V; Temperature Coefficient: ±200ppm/℃; Operating Temperature Range: -55℃~+155℃
R22 R29 = RE2512F3R008: 电阻类型:采样电阻；合金电阻;阻值:8mΩ;精度:±1%;功率:3W;温度系数:±100ppm/℃;; LCSC Part Name: 8mΩ 3W 2512 ±1%; Supplier Part: C46961752; Manufacturer: JIERR(捷而瑞); Supplier Footprint: 2512; JLCPCB Part Class: Extended Part; Datasheet: https://item.szlcsc.com/datasheet/RE2512F3R008/49133291.html; Supplier: LCSC; Type: 采样电阻；合金电阻; Tolerance: ±1%; Power(Watts): 3W; Temperature Coefficient: ±100ppm/℃
R23 R24 = 0805W8F220JT5E: 电阻类型:厚膜电阻;阻值:22Ω;精度:±1%;功率:125mW;工作电压:150V;温度系数:±100ppm/℃;; LCSC Part Name: 22Ω ±1% 125mW 厚膜电阻; Supplier Part: C17561; Manufacturer: UNI-ROYAL(厚声); Supplier Footprint: 0805; JLCPCB Part Class: Basic Part; Datasheet: https://item.szlcsc.com/datasheet/0805W8F220JT5E/18249.html; Supplier: LCSC; Type: 厚膜电阻; Tolerance: ±1%; Power(Watts): 125mW; Voltage-Supply(Max): 150V; Temperature Coefficient: ±100ppm/℃; Operating Temperature: -55℃~+155℃
R38 R39 = 0603WAF1000T5E: 电阻类型:厚膜电阻;阻值:100Ω;精度:±1%;功率:100mW;最大工作电压:75V;温度系数:±200ppm/℃;; LCSC Part Name: 100Ω ±1% 100mW 厚膜电阻; Supplier Part: C22775; Manufacturer: UNI-ROYAL(厚声); Supplier Footprint: 0603; JLCPCB Part Class: Basic Part; Datasheet: https://atta.szlcsc.com/upload/public/pdf/source/20200306/C422600_1E6D84923E4A46A82E41ADD87F860B5C.pdf; Supplier: LCSC; Type: 厚膜电阻; Tolerance: ±1%; Power(Watts): 100mW; Overload Voltage (Max): 75V; Temperature Coefficient: ±200ppm/℃; Operating Temperature Range: -55℃~+155℃
U4 = CH224K: CH224Q/CH224A 为支持USB PD3.2 的USB PD 快充协议受电芯片，最高支持PD3.2 EPR 140W 功率，并支持单电阻配置、I/O 电平配置及I2C 配置。通过I2C 接口可以读取协议握手状态和读取当前PD 档位额定电流。芯片内置高压LDO，静态功耗低，集成度高，外围精简。芯片集成输出电压检测及过压保护功能，可广泛应用于各类电子设备拓展高功率输入如无线充电器、小家电、锂电池电动工具等各类场合。; LCSC Part Name: USBPD等多快充协议受电芯片CH224; Supplier Part: C970725; Manufacturer: WCH(南京沁恒); Supplier Footprint: ESSOP-10-150mil-1mm; JLCPCB Part Class: Extended Part; Datasheet: https://item.szlcsc.com/datasheet/CH224K/1060460.html; Supplier: LCSC; Type: 受电控制器; Output Power: 100W; Output Voltage: 5V；20V；15V；12V；9V; Operating Temperature: -40℃~+90℃
U5 = LM2596S-12/NOPB: 功能类型:降压型;输出类型:固定;工作电压:4.5V~40V;输出电压:12V;输出电流:3A;; LCSC Part Name: 高效3A降压稳压器; Supplier Part: C95366; Manufacturer: TI(德州仪器); Supplier Footprint: TO-263-5; JLCPCB Part Class: Extended Part; Datasheet: https://www.ti.com/cn/lit/gpn/lm2596; Supplier: LCSC; Function: 降压型; Output Type: 固定; Voltage - Supply: 4.5V~40V; Output Voltage: 12V; Output Current: 3A; Frequency - Switching: 150kHz; Operating Temperature: -40℃~+125℃@(TJ); Synchronous Rectifier: 否; Number of Outputs: 1; Topology: 降压式; Switch tube (built-in/external): 内置
U6 = XL4005E1: 功能类型:降压型;工作电压:5V~32V;输出电压:800mV~30V;输出电流:5A;输出类型:可调;; LCSC Part Name: 32V 5A 300KHz 降压型DC-DC转换器; Supplier Part: C73332; Manufacturer: XLSEMI(芯龙); Supplier Footprint: TO-263-5; JLCPCB Part Class: Extended Part; Datasheet: https://item.szlcsc.com/datasheet/XL4005E1/74445.html; Supplier: LCSC; Function: 降压型; Voltage - Supply: 5V~32V; Output Voltage: 800mV~30V; Output Current: 5A; Frequency - Switching: 300kHz; Operating Temperature: -40℃~+125℃; Synchronous Rectifier: 否; Number of Outputs: 1; Topology: 降压式; Quiescent Current: 3mA; Switch tube (built-in/external): 内置; Output Type: 可调
U7 U8 = LM5109BMAX-JSM: 驱动配置:半桥;负载类型:MOSFET;驱动通道数:2;灌电流(IOL):1.5A;拉电流(IOH):1.2A;工作电压:9V~20V;上升时间(tr):50ns;下降时间(tf):40ns;; LCSC Part Name: 250V 1.2A 单相高低侧功率 MOSFET/IGBT 驱动芯片; Supplier Part: C7432827; Manufacturer: JSMSEMI(杰盛微); Supplier Footprint: SOP-8; JLCPCB Part Class: Extended Part; Datasheet: https://item.szlcsc.com/datasheet/LM5109BMAX-JSM/8438635.html; Supplier: LCSC; Driven Configuration: 半桥; Load Type: MOSFET; Number of Drivers: 2; Current - Output Low(IOL): 1.5A; Current - Output High(IOH): 1.2A; Voltage - Supply: 9V~20V; Rise Time: 50ns; Fall Time: 40ns; Features: 欠压保护(UVP); Operating Temperature: -40℃~+125℃; Quiescent Current(Iq): 160uA
U9 = CYA1265-22UH: 电感值:22uH;精度:±20%;额定电流:8A;饱和电流(Isat):14A;类型:一体成型电感;; LCSC Part Name: 22uH ±20% 14A; Supplier Part: C19268670; Manufacturer: SHOU HAN(首韩); Supplier Footprint: SMD,13.8x12.8mm; JLCPCB Part Class: Extended Part; Datasheet: https://atta.szlcsc.com/upload/public/pdf/source/20231127/DF34A1E091F11CE1F84988CEEBD91413.pdf; Supplier: LCSC; Tolerance: ±20%; Rated Current: 8A; Saturation Current (Isat): 14A; DC Resistance (DCR): 45Ω; Type: 一体成型电感
U10-U13 = 1N4007: Supplier Part: C9900004759; JLCPCB Part Class: Extended Part; Supplier: LCSC
U14 U16 = INA186A2IDDFR: 放大器数:单路;; Supplier Part: C2869854; Manufacturer: TI(德州仪器); Supplier Footprint: TSOT-23-8; JLCPCB Part Class: Extended Part; Datasheet: https://www.ti.com/cn/lit/gpn/ina186; Supplier: LCSC; Number of Channels: 单路; Supply Current: 48uA; Operating Temperature: -40℃~+125℃
U15 = GS8558-SR: 放大器数:双路;增益带宽积(GBP):13MHz;输入偏置电流(Ib):100pA;输入失调电压(Vos):5uV;压摆率(SR):8V/us;; Supplier Part: C2978613; Manufacturer: Gainsil(聚洵); Supplier Footprint: SOIC-8; JLCPCB Part Class: 扩展库; Datasheet: https://atta.szlcsc.com/upload/public/pdf/source/20220301/8E925AB8A777EC1CC32D65DB4BC8C388.pdf; Supplier: LCSC; Number of Circuits: 双路; Gain Bandwidth Product(GBP): 13MHz; Current - Input Bias(Ib): 100pA; Voltage - Input Offset(Vos): 5uV; Common Mode Rejection Ratio (CMRR): 100dB; Slew Rate(SR): 8V/us; Supply Voltage: 2.5V~5.5V; Output Current: 109mA; Input Offset Voltage Drift (Vos TC): 0.027uV/°C; Supply Current: 1.3mA; Operating Temperature: -40℃~+125℃

## Nets
GND: C1.1 C2.1 C3.1 C4.2 C5.2 C6.1 C7.1 C8.2 C9.2 C10.1 C11.1 C12.1 C13.1 C14.1 C15.1 C17.2 C18.2 C19.2 C20.2 C21.2 C22.2 C23.2 C25.2 C26.1 C27.1 C42.2 C43.2 C45.2 C46.2 C47.1 C48.2 C49.2 C50.2 D2.2(+) D4.1(A) H4.2 LDO1.2(VSS) R1.1 R4.2 R11.1 R32.1 R36.1 REST.1 SW3.2 SW4.2 SW5.2 SW6.2 U1.19(VSSA) U1.23(VSS) U1.35(VSS) U1.47(VSS) U2.1(GND) U5.3(GND) U5.5(ON/OFF) U5.6(GND) U6.1(GND) U14.3(REF) U14.4(GND) U15.4(VSS) U16.3(REF) U16.4(GND) USB1.1(GND) USB1.12(GND) USB1.13(SHELL) USB1.14(SHELL)
PGND: C28.2 C29.2 C30.2 C31.2 C32.1 C33.1 C34.1 C35.1 C36.1 C37.1 C40.1 C41.1 CNT2.1 CNT2.2 CNT2.3 CNT2.4 Q3.1(S) Q3.2(S) Q3.3(S) Q5.1(S) Q5.2(S) Q5.3(S) R4.1 R12.1 R13.1 R17.1 R19.1 R31.1 R35.1 R40.2 U7.4(VSS) U8.4(VSS)
VBUS: D3.1(C) FH1.2 Q1.1(S) Q1.2(S) Q1.3(S) R5.1 R7.1 R10.2
VCC5: C26.2 C42.1 C43.1 C50.1 D5.1(C) D8.1(C) LDO1.1(VIN) LDO1.3(CE) U14.1(VS) U14.2(ENABLE) U15.8(VDD) U16.1(VS) U16.2(ENABLE)
VCC12: C18.1 C19.1 C21.1 C40.2 C41.2 L2.2 R23.2 R24.2 U5.4(FEEDBACK) U6.4(EN) U6.5(VIN) U7.1(VCC) U8.1(VCC)
VCC20: C20.1 C28.1 C29.1 C32.2 C33.2 C34.2 Q1.5(D) Q1.6(D) Q1.7(D) Q1.8(D) R12.2 R22.1 R30.1 U5.1(VIN) U14.7(IN+)
VCC20_PWR: Q2.5(D) R22.2 U14.8(IN-)
VCC33: C1.2 C2.2 C3.2 C4.1 C5.1 C6.2 C7.2 C8.1 C9.1 C15.2 C27.2 C47.2 H4.5 LDO1.5(VOUT) R3.1 SW1.2 U1.1(VBAT) U1.20(VREF+) U1.21(VDDA) U1.24(VDD) U1.36(VDD) U1.48(VDD) U2.4(V3) U2.16(VCC)
VIN-: C16.2 D3.2(A) R8.1 R40.1 U4.11(GND) USB2.1(GND) USB2.12(GND) USB2.13(SHELL) USB2.14(SHELL)
ADC_I_OUT: U1.9(PA1) U16.5(OUT)
ADC_I_PWR: U1.8(PA0) U14.5(OUT)
ADC_V_IN: C45.1 R38.2 U1.11(PA3)
ADC_V_OUT: C46.1 R39.2 U1.10(PA2)
CH224K_CC1: U4.7(CC1) USB2.4(CC1)
CH224K_CC2: U4.6(CC2) USB2.10(CC2)
CH224K_DM: U4.5(DM) USB2.5(DN2) USB2.7(DN1)
CH224K_DP: U4.4(DP) USB2.6(DP1) USB2.8(DP2)
CH224K_PG: R6.2 U4.10(PG)
CH340C_RXD: U1.31(PA9) U2.3(RXD)
CH340C_TXD: U1.32(PA10) U2.2(TXD)
D+: U2.5(D+) USB1.6(DP1) USB1.8(DP2)
D-: U2.6(D-) USB1.5(DN2) USB1.7(DN1)
JTCK/SWCLK: H4.3 U1.38(PA14)
JTMS/SWDIO: H4.4 U1.37(PA13)
MCU_PWM_H1: U1.26(PB12) U7.2(HIN)
MCU_PWM_H2: U1.28(PB14) U8.2(HIN)
MCU_PWM_L1: U1.27(PB13) U7.3(LIN)
MCU_PWM_L2: U1.29(PB15) U8.3(LIN)
MOS_PWM_H1: R14.1 R25.2 U10.2(A)
MOS_PWM_H2: R21.2 R27.2 U12.2(A)
MOS_PWM_L1: R15.1 R26.2 U11.2(A)
MOS_PWM_L2: R18.1 R28.2 U13.2(A)
PA5: C48.1 H2.10 SW6.1 U1.13(PA5)
PA6: C49.1 H2.9 SW4.1 U1.14(PA6)
PA7: C25.1 H2.8 SW5.1 U1.15(PA7)
PA8: H2.2 U1.30(PA8)
PA11: H2.1 U1.33(PA11)
PA12: H3.10 U1.34(PA12)
PA15: H3.9 U1.39(PA15)
PB0: C17.1 H2.7 SW3.1 U1.16(PB0)
PB1: H2.6 U1.17(PB1)
PB2: H2.5 U1.18(PB2)
PB3: H3.8 U1.40(PB3)
PB4: H3.7 U1.41(PB4)
PB5: H3.6 U1.42(PB5)
PB6: H3.5 U1.43(PB6)
PB7: H3.4 U1.44(PB7)
PB8-BOOT0: R1.2 SW1.1 U1.45(PB8-BOOT0)
PB9: H3.3 U1.46(PB9)
PB10: H2.4 U1.22(PB10)
PB11: H2.3 U1.25(PB11)
PC13: H3.2 U1.2(PC13)
PC14: H3.1
PC14-OSC32_IN: C13.2 U1.3(PC14-OSC32_IN) X2.1
PC15-OSC32_OUT: C14.2 U1.4(PC15-OSC32_OUT) X2.2
PF0-OSC_IN: C12.2 U1.5(PF0-OSC_IN) X1.1(OSC1)
PF1-OSC_OUT: C11.2 U1.6(PF1-OSC_OUT) X1.2(OSC2)
PG10-NRST: C10.2 H4.1 R3.2 REST.2 U1.7(PG10-NRST)
SW1: C38.1 Q2.1(S) Q2.2(S) Q2.3(S) Q3.5(D) R16.1 U7.6(VS) U9.1
SW2: C39.1 Q4.1(S) Q4.2(S) Q4.3(S) Q5.5(D) R20.1 U8.6(VS) U9.2
VOUT+: CNT1.1 CNT1.2 CNT1.3 CNT1.4 R29.2 R34.1 U16.8(IN-)
VOUT_FINAL: C30.1 C31.1 C35.2 C36.2 C37.2 Q4.5(D) R13.2 R29.1 U16.7(IN+)
XL4005E1_FB: C24.2 R9.1 R11.2 U6.2(FB)
$1N8: FH1.1 USB2.2(VBUS) USB2.11(VBUS)
$1N11: Q1.4(G) R5.2 R6.1
$1N18: R7.2 U4.8(VBUS)
$1N27: C16.1 R10.1 U4.1(VDD)
$1N38: R8.2 U4.9(CFG1)
$1N43: D2.1(-) L2.1 U5.2(OUTPUT)
$1N50: D4.2(K) L1_5A.2 U6.3(SW) U6.6(SW)
$1N59: C22.1 C23.1 C24.1 D5.2(A) L1_5A.1 R9.2
$1N71: Q2.4(G) R14.2 R16.2
$1N72: Q3.4(G) R15.2 R17.2
$1N76: Q5.4(G) R18.2 R19.2
$1N81: Q4.4(G) R20.2 R21.1
$1N86: D6.2(A) R23.1
$1N87: C38.2 D6.1(K) U7.8(VB)
$1N89: R25.1 U7.7(HO) U10.1(K)
$1N90: R26.1 U7.5(LO) U11.1(K)
$1N97: R28.1 U8.5(LO) U13.1(K)
$1N100: C39.2 D7.1(K) U8.8(VB)
$1N101: D7.2(A) R24.1
$1N105: R27.1 U8.7(HO) U12.1(K)
$1N139: R30.2 R33.2 U15.2(-INA)
$1N140: R31.2 R32.2 U15.3(+INA)
$1N144: R33.1 R38.1 U15.1(OUTA)
$1N147: R35.2 R36.2 U15.5(+INB)
$1N149: R34.2 R37.2 U15.6(-INB)
$1N150: R37.1 R39.1 U15.7(OUTB)
$2N73: D8.2(A) USB1.2(VBUS) USB1.11(VBUS)

Not connected (* = marked no-connect by the designer): LDO1 4(NC)*; U1 12(PA4)*; U2 7(NC.)* 8(OUT#)* 9(CTS#)* 10(DSR#)* 11(RI#)* 12(DCD#)* 13(DTR#)* 14(RTS#)* 15(R232)*; U4 2(CFG2)* 3(CFG3)*; U14 6(NC)*; U16 6(NC)*; USB1 3(SBU2)* 4(CC1)* 9(SBU1)* 10(CC2)*; USB2 3(SBU2)* 9(SBU1)*

## Notes on the sheets
sheet 1
- 电源输入和诱骗
- 5V转33
- boost-buck电路
- 20V转12V
- 12V转5V
- 电流采样
- 电压采样
sheet 2
- USB转串口
- 启动电路
- 晶振
- 下载电路
- 复位电路
